# EAGLE design Minduino_A (EAGLE 6.2)
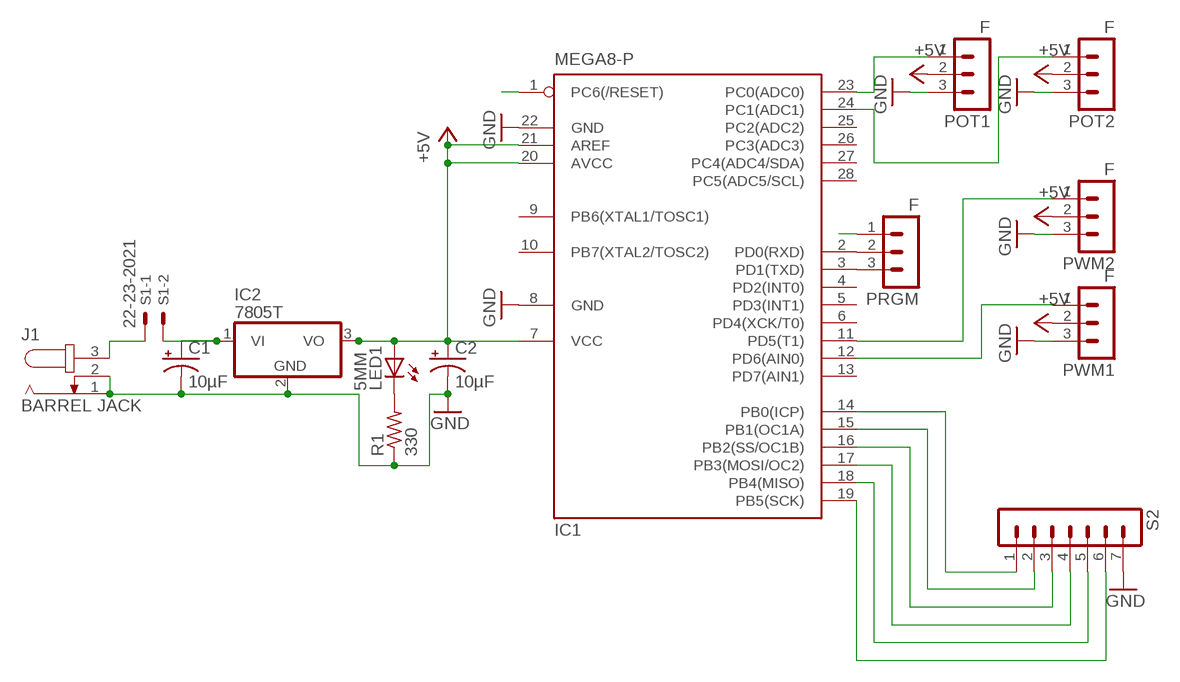
[diagram p0: schematic, sheet 1]

## Parts
C1  10µF  CPOL-USE2.5-5  [E2,5-5]
C2  10µF  CPOL-USE2.5-5  [E2,5-5]
IC1  MEGA8-P  [DIL28-3]
IC2  7805T  [TO220H]
J1  BARREL JACK  JACK-PLUG1  [SPC4078]
LED1  5MM  LED5MM  [LED5MM]
POT1  F  MA03-1  [MA03-1]
POT2  F  MA03-1  [MA03-1]
PRGM  F  MA03-1  [MA03-1]
PWM1  F  MA03-1  [MA03-1]
PWM2  F  MA03-1  [MA03-1]
R1  330  R-US_0204/5  [0204/5]
S1  22-23-2021  [22-23-2021]
S2  MA07-1  [MA07-1]

## Nets
+5V: C2.+ IC1.7(VCC) IC1.20(AVCC) IC1.21(AREF) IC2.3(VO) LED1.A POT1.2 POT2.2 PWM1.2 PWM2.2
GND: C1.- C2.- IC1.8(GND) IC1.22(GND) IC2.2(GND) J1.1 J1.2 POT1.3 POT2.3 PWM1.3 PWM2.3 R1.1 S2.7
N$1: IC1.12(PD6(AIN0)) PWM1.1
N$2: LED1.K(C) R1.2
N$3: IC1.11(PD5(T1)) PWM2.1
N$4: IC1.14(PB0(ICP)) S2.1
N$5: C1.+ IC2.1(VI) S1.2
N$6: IC1.23(PC0(ADC0)) POT1.1
N$7: IC1.24(PC1(ADC1)) POT2.1
N$8: IC1.15(PB1(OC1A)) S2.2
N$9: IC1.16(PB2(SS/OC1B)) S2.3
N$10: IC1.17(PB3(MOSI/OC2)) S2.4
N$11: IC1.18(PB4(MISO)) S2.5
N$12: IC1.19(PB5(SCK)) S2.6
N$13: J1.3 S1.1
N$15: IC1.2(PD0(RXD)) PRGM.2
N$16: IC1.3(PD1(TXD)) PRGM.3
RST: IC1.1(PC6(/RESET)) PRGM.1
Unconnected: IC1.4(PD2(INT0)) IC1.5(PD3(INT1)) IC1.6(PD4(XCK/T0)) IC1.9(PB6(XTAL1/TOSC1)) IC1.10(PB7(XTAL2/TOSC2)) IC1.13(PD7(AIN1)) IC1.25(PC2(ADC2)) IC1.26(PC3(ADC3)) IC1.27(PC4(ADC4/SDA)) IC1.28(PC5(ADC5/SCL))

## Library data of the parts
C1 C2 = resistor:CPOL-US: POLARIZED CAPACITOR, American symbol
IC1 = atmel:MEGA8-P: MICROCONTROLLER 8 Kbytes FLASH, 1 kbytes SRAM, 512 bytes EEPROM, USART, 4-channel 10 bit ADC, 2-channel 8 bit ADC Pin compatible with Atmega48, ATMega88, ATMega168 Source: avr.lbr; OC_FARNELL: unknown; OC_NEWARK: unknown
IC2 = linear:78*: Positive VOLTAGE REGULATOR Source: http://cache.national.com/ds/LM/LM78L05.pdf http://www.fairchildsemi.com/ds/LM/LM7805.pdf
J1 = con-jack:JACK-PLUG: DC POWER JACK Power Jack, DC, Right Angle, Through Hole, Rated 5A at 16VDC, PC Terminals Distributor: Farnell (www.Farnell.de) Drawing: 84N1161.pdf / 84N1162.pdf Manufacturer: SPC Technology (www.spctechnology.com) Type: SPC4077 / SPC 4078; OC_FARNELL: unknown; OC_NEWARK: unknown
LED1 = led:LED: LED OSRAM: - CHIPLED LG R971, LG N971, LY N971, LG Q971, LY Q971, LO R971, LY R971 LH N974, LH R974 LS Q976, LO Q976, LY Q976 LO Q996 - Hyper CHIPLED LW Q18S LB Q993, LB Q99A, LB R99A - SideLED LS A670, LO A670, LY A670, LG A670, LP A670 LB A673, LV A673, LT A673, LW A673 LH A674 LY A675 LS A676, LA A676, LO A676, LY A676, LW A676 LS A679, LY A679, LG A679 - Hyper Micro SIDELED® LS Y876, LA Y876, LO Y876, LY Y876 LT Y87S - SmartLED LW L88C, LW L88S LB L89C, LB L89S, LG L890 LS L89K, LO L89K, LY L89K LS L896, LA L896, LO L896, LY L896 - TOPLED LS T670, LO T670, LY T670, LG T670, LP T670 LSG T670, LSP T670, LSY T670, LOP T670, LYG T670 LG T671, LOG T671, LSG T671 LB T673, LV T673, LT T673, LW T673 LH T674 LS T676, LA T676, LO T676, LY T676, LB T676, LH T676, LSB T676, LW T676 LB T67C, LV T67C, LT T67C, LS T67K, LO T67K, LY T67K, LW E67C LS E67B, LA E67B, LO E67B, LY E67B, LB E67C, LV E67C, LT E67C LW T67C LS T679, LY T679, LG T679 LS T770, LO T770, LY T770, LG T770, LP T770 LB T773, LV T773, LT T773, LW T773 LH T774 LS E675, LA E675, LY E675, LS T675 LS T776, LA T776, LO T776, LY T776, LB T776 LHGB T686 LT T68C, LB T68C - Hyper Mini TOPLED® LB M676 - Mini TOPLED Santana® LG M470 LS M47K, LO M47K, LY M47K Source: http://www.osram.convergy.de LUXEON: - LUMILED® LXK2-PW12-R00, LXK2-PW12-S00, LXK2-PW14-U00, LXK2-PW14-V00 LXK2-PM12-R00, LXK2-PM12-S00, LXK2-PM14-U00 LXK2-PE12-Q00, LXK2-PE12-R00, LXK2-PE12-S00, LXK2-PE14-T00, LXK2-PE14-U00 LXK2-PB12-K00, LXK2-PB12-L00, LXK2-PB12-M00, LXK2-PB14-N00, LXK2-PB14-P00, LXK2-PB14-Q00 LXK2-PR12-L00, LXK2-PR12-M00, LXK2-PR14-Q00, LXK2-PR14-R00 LXK2-PD12-Q00, LXK2-PD12-R00, LXK2-PD12-S00 LXK2-PH12-R00, LXK2-PH12-S00 LXK2-PL12-P00, LXK2-PL12-Q00, LXK2-PL12-R00 Source: www.luxeon.com KINGBRIGHT: KA-3528ASYC Source: www.kingbright.com
POT1 POT2 PRGM PWM1 PWM2 = con-lstb:MA03-1: PIN HEADER; OC_FARNELL: unknown; OC_NEWARK: unknown
R1 = resistor:R-US_: RESISTOR, American symbol
S1 = con-molex:22-23-2021: .100" (2.54mm) Center Header - 2 Pin; MF: MOLEX; MPN: 22-23-2021; OC_FARNELL: 1462926; OC_NEWARK: 25C3832
S2 = con-lstb:MA07-1: PIN HEADER; OC_FARNELL: unknown; OC_NEWARK: unknown

## Board
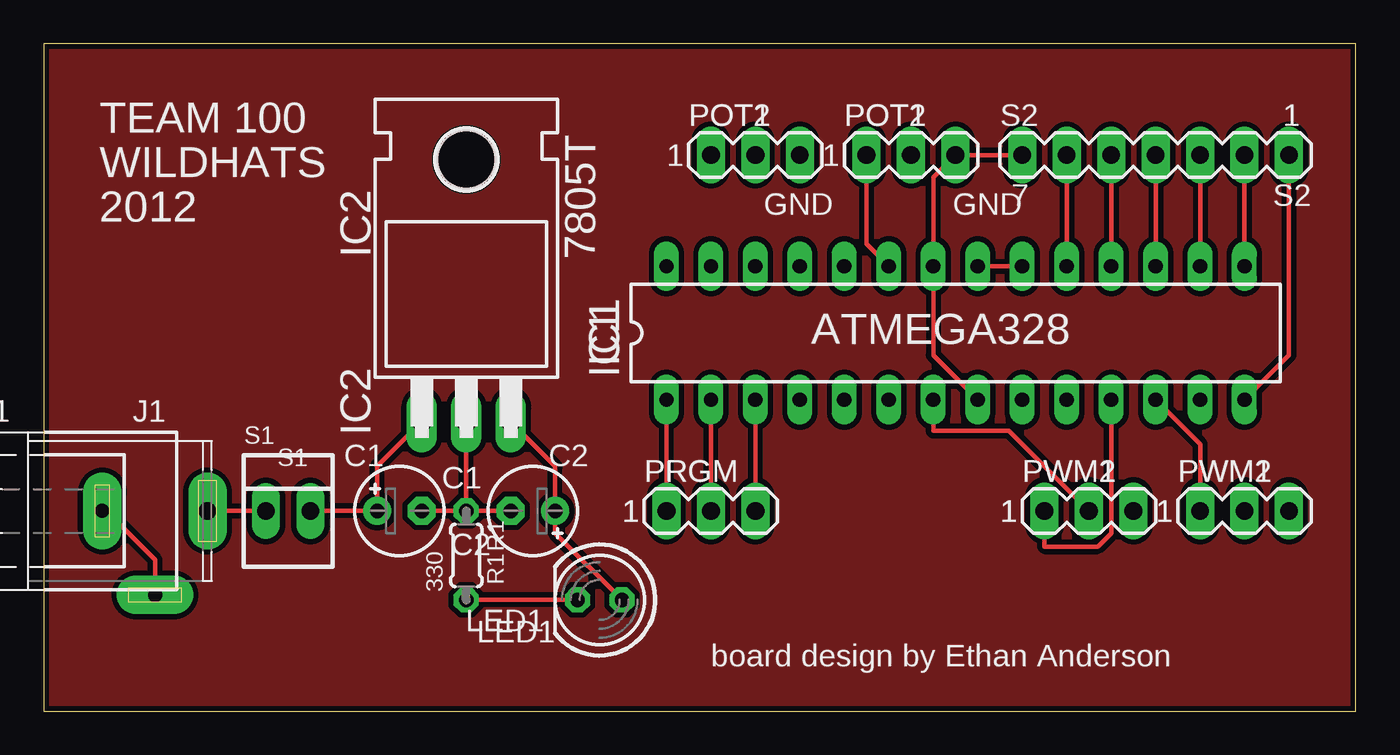
[diagram p1: board, top side]
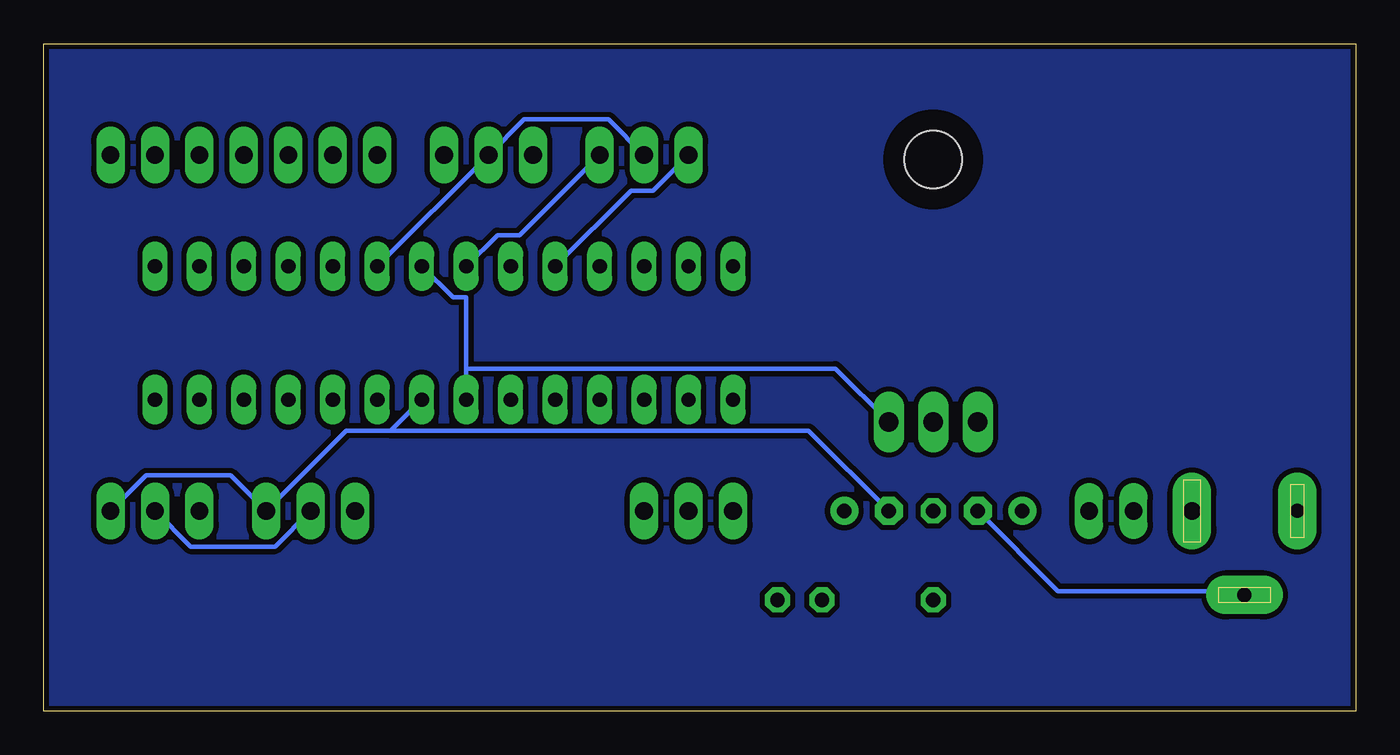
[diagram p2: board, bottom side, seen from below]

Size 74.93 x 38.1 mm. Coordinates in mm from the lower left corner, seen from the top.
Outline: 0,0 74.93,0 74.93,38.1 0,38.1 0,0
Copper layers (1*16): Top 0.035mm / dielectric 1.5mm / Bottom 0.035mm
Design rules: minimum track width 8mil, minimum drill 20mil, track to track 8mil, track to pad 8mil, pad to pad 8mil, via to via 8mil, smd to smd 8mil, copper to edge 10mil, drill to drill 8mil, minimum pad ring 12mil, minimum via ring 10mil, stop-mask expansion 4mil, vias tented up to drill 25mil, thermal gap 10mil

### Footprints (pad centres in the part's own frame; a part is rotated, then mirrored left to right if it is on the bottom)
E2,5-5 = drill 0.813 pad 1.6: + -1.27,0 | drill 0.813 pad 1.6 octagon: - 1.27,0
DIL28-3 = drill 0.813 long: 1 -16.51,-3.81; 2 -13.97,-3.81; 3 -11.43,-3.81; 4 -8.89,-3.81; 5 -6.35,-3.81; 6 -3.81,-3.81; 7 -1.27,-3.81; 8 1.27,-3.81; 9 3.81,-3.81; 10 6.35,-3.81; 11 8.89,-3.81; 12 11.43,-3.81; 13 13.97,-3.81; 14 16.51,-3.81; 15 16.51,3.81; 16 13.97,3.81; 17 11.43,3.81; 18 8.89,3.81; 19 6.35,3.81; 20 3.81,3.81; 21 1.27,3.81; 22 -1.27,3.81; 23 -3.81,3.81; 24 -6.35,3.81; 25 -8.89,3.81; 26 -11.43,3.81; 27 -13.97,3.81; 28 -16.51,3.81
TO220H = drill 1.118 long: 1 -2.54,-10.16; 2 0,-10.16; 3 2.54,-10.16 | hole 3.302: 0,4.826
SPC4078 = drill 0.8 pad 2.184 long: 1 -3,0; 2 0,-4.8 | drill 1 pad 2.184 long: 3 3,0
LED5MM = drill 0.813 octagon: A -1.27,0; K 1.27,0
MA03-1 = drill 1.016 long: 1 -2.54,0; 2 0,0; 3 2.54,0
0204/5 = drill 0.813 octagon: 1 -2.54,0; 2 2.54,0
22-23-2021 = drill 1 long: 1 -1.27,0; 2 1.27,0
MA07-1 = drill 1.016 long: 1 -7.62,0; 2 -5.08,0; 3 -2.54,0; 4 0,0; 5 2.54,0; 6 5.08,0; 7 7.62,0

### Placement (x,y rotation side)
C1  20.32,11.43 0 top
C2  27.94,11.43 180 top
IC1  52.07,21.59 0 top
IC2  24.13,26.67 0 top
J1  6.35,11.43 0 top
LED1  31.75,6.35 180 top
POT1  49.53,31.75 0 top
POT2  40.64,31.75 0 top
PRGM  38.1,11.43 0 top
PWM1  68.58,11.43 0 top
PWM2  59.69,11.43 0 top
R1  24.13,8.89 270 top
S1  13.97,11.43 0 top
S2  63.5,31.75 180 top

### Tracks (layer width: path | path; a pad name or v marks a point on that pad's centre or on a via)
+5V
  Top 0.254: LED1.A 29.21,10.16 C2.+ 29.21,13.97 IC2.3 | IC1.21 IC1.20 | PWM2.2 55.12,16 50.8,16 IC1.7
  Bottom 0.254: PWM2.2 61.72,9.4 66.55,9.4 PWM1.2 | POT2.2 42.67,33.78 47.5,33.78 POT1.2 IC1.20 | 50.8,19.56 50.8,23.62 51.56,23.62 IC1.21 | 50.8,19.56 IC1.7 | IC2.3 29.72,19.56 50.8,19.56
GND
  Top 0.254: C1.- R1.1 | R1.1 C2.- | R1.1 IC2.2 | J1.2 6.35,8.64 3.56,11.43 J1.1 | S2.7 POT1.3 50.8,30.48 IC1.22 50.8,20.32 IC1.8
  Bottom 0.254: C1.- 17.02,6.86 6.35,6.86 J1.2 | PWM1.3 69.09,13.46 64.26,13.46 PWM2.3 57.66,16 55.12,16 | POT2.3 47.75,27.18 49.02,27.18 IC1.22 | IC1.8 55.12,16 | C2.- 31.24,16 55.12,16
N$1
  Top 0.254: IC1.12 66.04,15.24 PWM1.1
N$2
  Top 0.254: LED1.K R1.2
N$3
  Top 0.254: IC1.11 60.96,10.16 60.2,9.4 57.15,9.4 PWM2.1
N$4
  Top 0.254: IC1.14 71.12,20.32 S2.1
N$5
  Top 0.254: S1.2 C1.+ 19.05,13.97 IC2.1
N$6
  Top 0.254: IC1.23 46.99,26.67 POT1.1
N$7
  Bottom 0.254: IC1.24 41.4,29.72 40.13,29.72 POT2.1
N$8
  Top 0.254: S2.2 IC1.15
N$9
  Top 0.254: S2.3 IC1.16
N$10
  Top 0.254: S2.4 IC1.17
N$11
  Top 0.254: S2.5 IC1.18
N$12
  Top 0.254: S2.6 IC1.19
N$13
  Top 0.254: J1.3 S1.1
N$14
  pour Bottom (isolate 0.305): 0,0 74.93,0 74.93,38.1 0,38.1
N$15
  Top 0.254: PRGM.2 IC1.2
N$16
  Top 0.254: PRGM.3 IC1.3
N$17
  pour Top (isolate 0.305): 0,0 74.93,0 74.93,38.1 0,38.1
RST
  Top 0.254: PRGM.1 IC1.1

### Text on the board
_tsilk: TEAM 100 | POT1 | POT2 | S2 | WILDHATS | GND | GND | 2012 | IC2 | 7805T | ATMEGA328 | IC1 | J1 | C2 | S1 | C1 | PRGM | PWM1 | PWM2 | 1 | 1 | 1 | 330 | R1 | LED1 | board design by Ethan Anderson